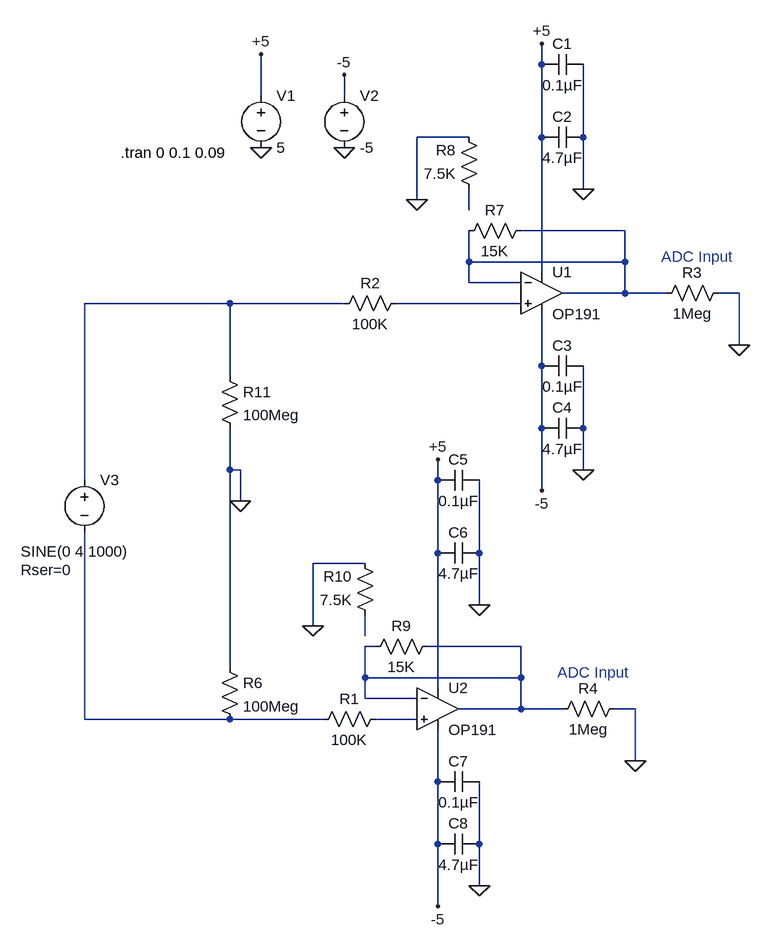
[diagram p0: schematic DifferentialBuffer.asc]
DifferentialBuffer.asc, the LTspice schematic file:
Version 4
SHEET 1 880 1188
WIRE 176 -192 176 -224
WIRE -256 -144 -256 -208
WIRE -128 -144 -128 -176
WIRE 64 -80 -16 -80
WIRE 176 -80 176 -192
WIRE 240 -80 240 -192
WIRE 240 0 240 -80
WIRE -16 16 -16 -80
WIRE 64 32 64 0
WIRE 304 64 144 64
WIRE 64 112 64 64
WIRE 304 112 304 64
WIRE 304 112 64 112
WIRE 176 128 176 -80
WIRE 64 144 64 112
WIRE 144 144 64 144
WIRE 304 160 304 112
WIRE 304 160 208 160
WIRE 368 160 304 160
WIRE 480 160 448 160
WIRE -304 176 -528 176
WIRE -128 176 -304 176
WIRE 144 176 -48 176
WIRE 480 240 480 160
WIRE 176 272 176 192
WIRE -304 288 -304 176
WIRE 176 368 176 272
WIRE 240 368 240 272
WIRE -304 432 -304 368
WIRE -288 432 -304 432
WIRE 240 432 240 368
WIRE -528 448 -528 176
WIRE 16 448 16 416
WIRE 176 464 176 368
WIRE -288 480 -288 432
WIRE 16 560 16 448
WIRE 80 560 80 448
WIRE -96 576 -176 576
WIRE 80 640 80 560
WIRE -176 672 -176 576
WIRE -96 688 -96 656
WIRE -80 704 -96 704
WIRE 144 704 0 704
WIRE -304 736 -304 432
WIRE -96 752 -96 704
WIRE 144 752 144 704
WIRE 144 752 -96 752
WIRE 16 768 16 560
WIRE -96 784 -96 752
WIRE -16 784 -96 784
WIRE 144 800 144 752
WIRE 144 800 48 800
WIRE 208 800 144 800
WIRE 320 800 288 800
WIRE -528 816 -528 528
WIRE -304 816 -528 816
WIRE -160 816 -304 816
WIRE -16 816 -80 816
WIRE 320 880 320 800
WIRE 16 912 16 832
WIRE 16 1008 16 912
WIRE 80 1008 80 912
WIRE 80 1072 80 1008
WIRE 16 1104 16 1008
FLAG -128 -64 0
FLAG -256 -64 0
FLAG 480 240 0
FLAG 240 0 0
FLAG 240 432 0
FLAG 176 -224 +5
FLAG -256 -208 +5
FLAG 176 464 -5
FLAG -128 -176 -5
FLAG 320 880 0
FLAG 80 640 0
FLAG 80 1072 0
FLAG 16 416 +5
FLAG 16 1104 -5
FLAG -288 480 0
FLAG -16 16 0
FLAG -176 672 0
SYMBOL OpAmps\\OP191 176 96 R0
SYMATTR InstName U1
SYMBOL voltage -256 -160 R0
WINDOW 123 0 0 Left 0
WINDOW 39 0 0 Left 0
SYMATTR InstName V1
SYMATTR Value 5
SYMBOL voltage -128 -160 R0
WINDOW 123 0 0 Left 0
WINDOW 39 0 0 Left 0
SYMATTR InstName V2
SYMATTR Value -5
SYMBOL res -32 160 R90
WINDOW 0 0 56 VBottom 2
WINDOW 3 32 56 VTop 2
SYMATTR InstName R2
SYMATTR Value 100K
SYMBOL res 464 144 R90
WINDOW 0 0 56 VBottom 2
WINDOW 3 32 56 VTop 2
SYMATTR InstName R3
SYMATTR Value 1Meg
SYMBOL cap 240 -208 R90
WINDOW 0 0 32 VBottom 2
WINDOW 3 32 32 VTop 2
SYMATTR InstName C1
SYMATTR Value 0.1µF
SYMBOL cap 240 -96 R90
WINDOW 0 0 32 VBottom 2
WINDOW 3 32 32 VTop 2
SYMATTR InstName C2
SYMATTR Value 4.7µF
SYMBOL cap 240 256 R90
WINDOW 0 0 32 VBottom 2
WINDOW 3 32 32 VTop 2
SYMATTR InstName C3
SYMATTR Value 0.1µF
SYMBOL cap 240 352 R90
WINDOW 0 0 32 VBottom 2
WINDOW 3 32 32 VTop 2
SYMATTR InstName C4
SYMATTR Value 4.7µF
SYMBOL voltage -528 432 R0
WINDOW 3 -98 126 Left 2
WINDOW 123 0 0 Left 0
WINDOW 39 -98 154 Left 2
SYMATTR InstName V3
SYMATTR Value SINE(0 4 1000)
SYMATTR SpiceLine Rser=0
SYMBOL OpAmps\\OP191 16 736 R0
SYMATTR InstName U2
SYMBOL res -64 800 R90
WINDOW 0 0 56 VBottom 2
WINDOW 3 32 56 VTop 2
SYMATTR InstName R1
SYMATTR Value 100K
SYMBOL res 304 784 R90
WINDOW 0 0 56 VBottom 2
WINDOW 3 32 56 VTop 2
SYMATTR InstName R4
SYMATTR Value 1Meg
SYMBOL cap 80 432 R90
WINDOW 0 0 32 VBottom 2
WINDOW 3 32 32 VTop 2
SYMATTR InstName C5
SYMATTR Value 0.1µF
SYMBOL cap 80 544 R90
WINDOW 0 0 32 VBottom 2
WINDOW 3 32 32 VTop 2
SYMATTR InstName C6
SYMATTR Value 4.7µF
SYMBOL cap 80 896 R90
WINDOW 0 0 32 VBottom 2
WINDOW 3 32 32 VTop 2
SYMATTR InstName C7
SYMATTR Value 0.1µF
SYMBOL cap 80 992 R90
WINDOW 0 0 32 VBottom 2
WINDOW 3 32 32 VTop 2
SYMATTR InstName C8
SYMATTR Value 4.7µF
SYMBOL res -320 720 R0
SYMATTR InstName R6
SYMATTR Value 100Meg
SYMBOL res 160 48 R90
WINDOW 0 0 56 VBottom 2
WINDOW 3 32 56 VTop 2
SYMATTR InstName R7
SYMATTR Value 15K
SYMBOL res 80 16 R180
WINDOW 0 36 76 Left 2
WINDOW 3 36 40 Left 2
SYMATTR InstName R8
SYMATTR Value 7.5K
SYMBOL res 16 688 R90
WINDOW 0 0 56 VBottom 2
WINDOW 3 32 56 VTop 2
SYMATTR InstName R9
SYMATTR Value 15K
SYMBOL res -80 672 R180
WINDOW 0 36 76 Left 2
WINDOW 3 36 40 Left 2
SYMATTR InstName R10
SYMATTR Value 7.5K
SYMBOL res -320 272 R0
SYMATTR InstName R11
SYMATTR Value 100Meg
TEXT -472 -56 Left 2 !.tran 0 0.1 0.09
TEXT 360 104 Left 2 ;ADC Input
TEXT 200 744 Left 2 ;ADC Input

The netlist it stands for:
* DifferentialBuffer.asc
XU1 N004 N002 +5 -5 N002 OP191  ; pins In+ In- V+ V- OUT
V1 +5 0 5
V2 -5 0 -5
R2 N004 N003 100K
R3 0 N002 1Meg
C1 0 +5 0.1µF
C2 0 +5 4.7µF
C3 0 -5 0.1µF
C4 0 -5 4.7µF
V3 N003 N007 SINE(0 4 1000) Rser=0
XU2 N008 N006 +5 -5 N006 OP191  ; pins In+ In- V+ V- OUT
R1 N008 N007 100K
R4 0 N006 1Meg
C5 0 +5 0.1µF
C6 0 +5 4.7µF
C7 0 -5 0.1µF
C8 0 -5 4.7µF
R6 0 N007 100Meg
R7 N002 N002 15K
R8 N001 0 7.5K
R9 N006 N006 15K
R10 N005 0 7.5K
R11 N003 0 100Meg
.tran 0 0.1 0.09
* ADC Input
* ADC Input
.lib ADI.lib
.backanno
.end